# EAGLE design AUX power board (EAGLE 7.5.0)
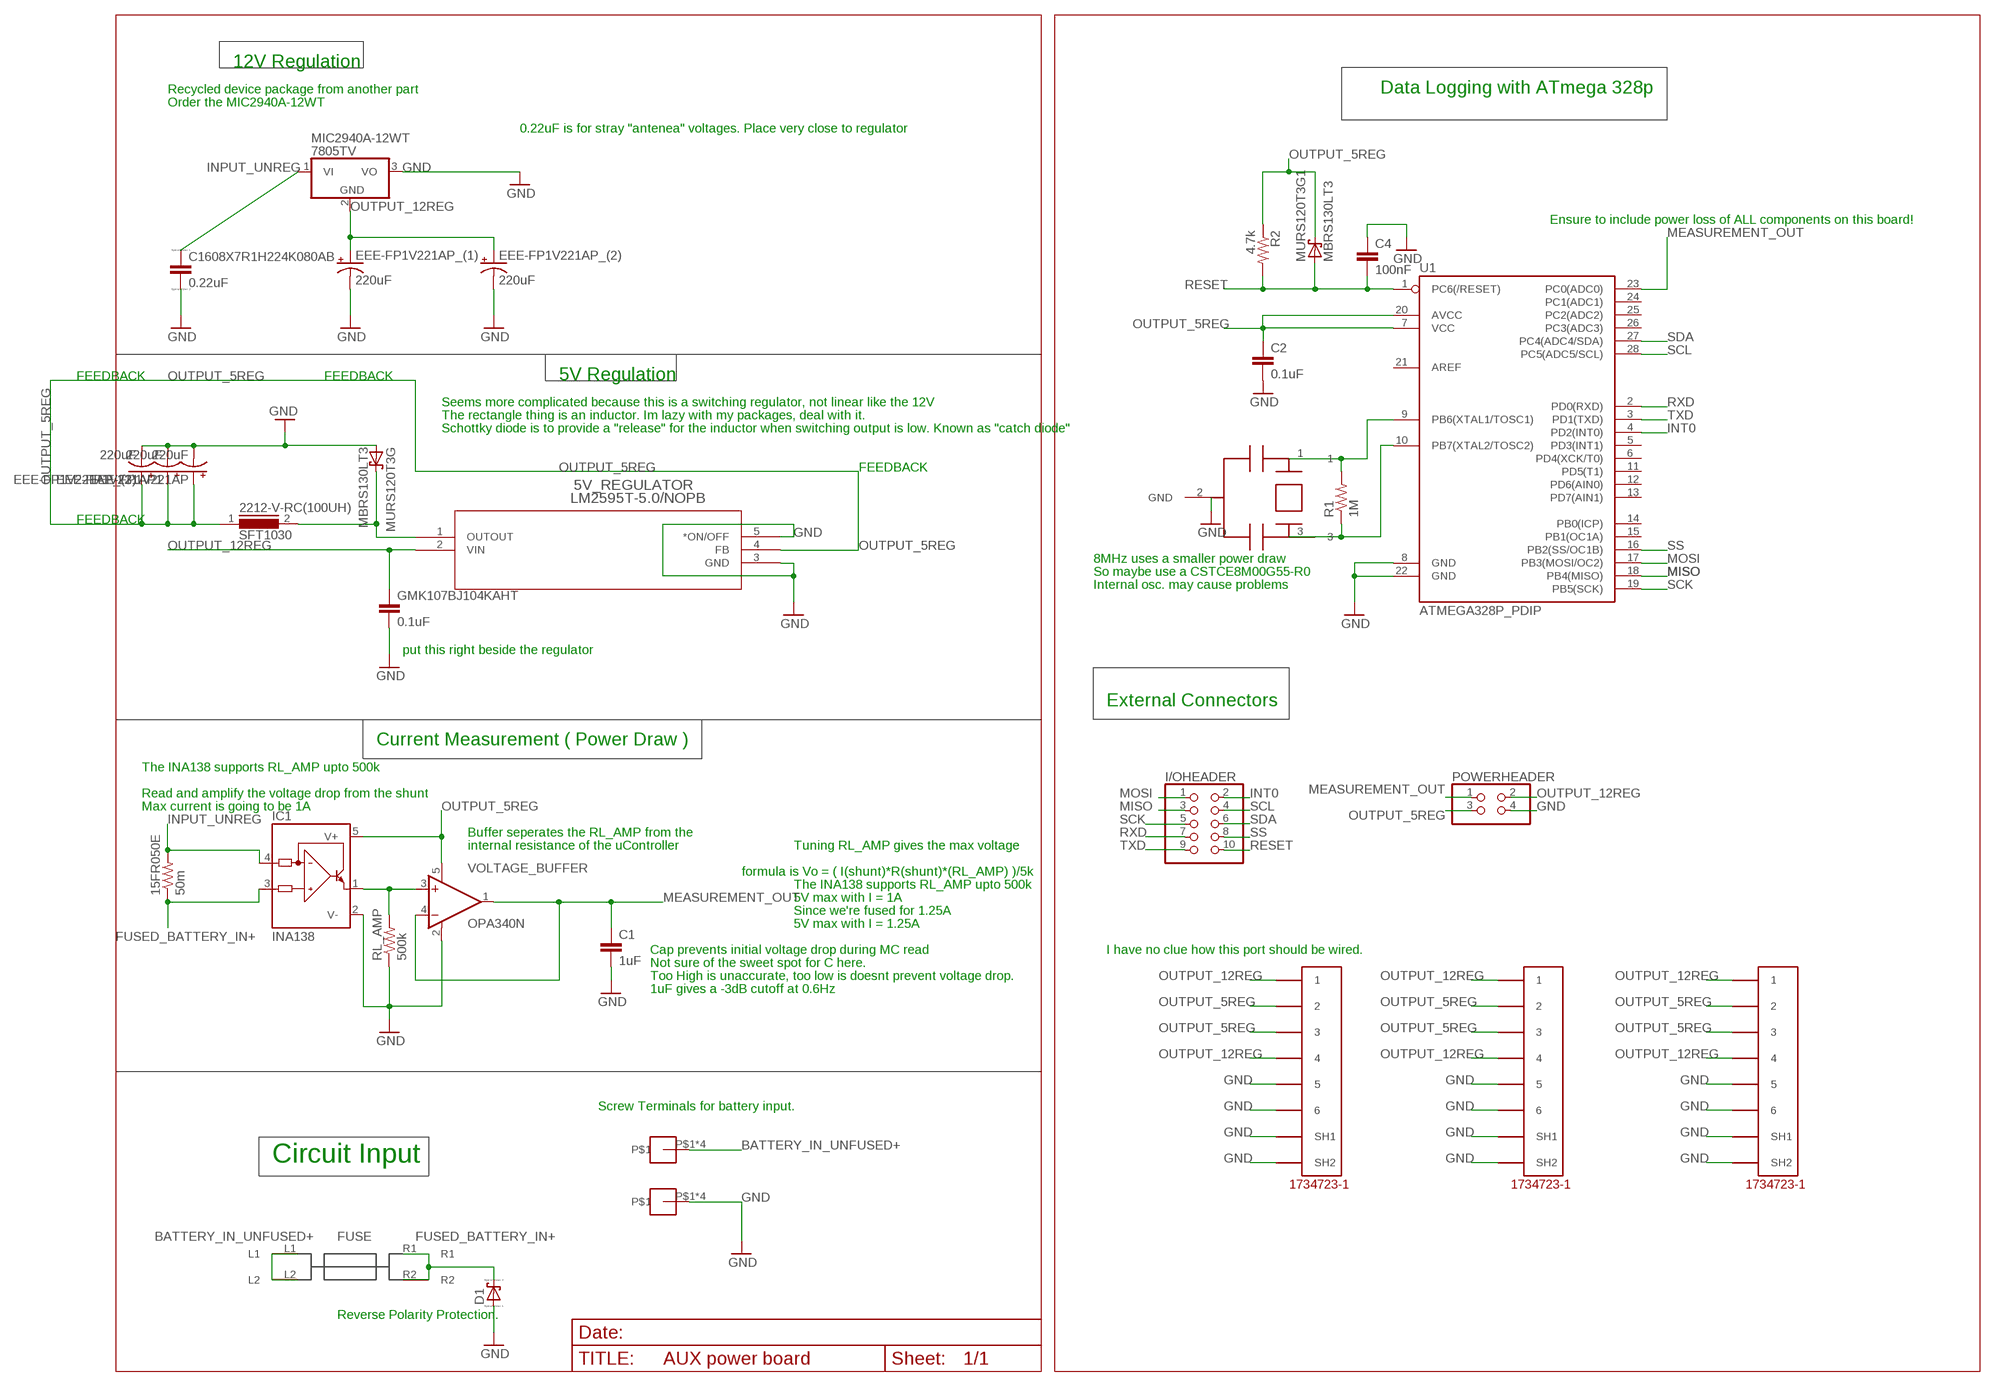
[diagram p0: schematic, sheet 1]

## Parts
5V_REGULATOR  LM2595T-5.0/NOPB  [T05D]
15FR050E  50m  R-US_0617/22  [0617/22]
2212-V-RC(100UH)  SFT1030  [SFT1030]
C1  1uF  C-EUC0603  [C0603]
C2  0.1uF  C-EUC0603  [C0603]
C4  100nF  C-EUC0603  [C0603]
C1608X7R1H224K080AB  0.22uF  CC0603  [C0603]
D1  SCHOTTKY-DIODESMC  [DIODE_SMC]
EEE-FP1V221AP  220uF  CPOL-US175TMP-0808  [175TMP-0808]
EEE-FP1V221AP1  220uF  CPOL-US175TMP-0808  [175TMP-0808]
EEE-FP1V221AP_(1)  220uF  CPOL-US175TMP-0808  [175TMP-0808]
EEE-FP1V221AP_(2)  220uF  CPOL-US175TMP-0808  [175TMP-0808]
EEE-FP1V221AP_(3)  220uF  CPOL-US175TMP-0808  [175TMP-0808]
GMK107BJ104KAHT  0.1uF  C-EUC0603  [C0603]
I/OHEADER  PINHD-2X5  [2X05]
IC1  INA138  [SOT23-5]
MIC2940A-12WT  7805TV  [TO220V]
MINIBLADE  3568  [3568]
MURS120T3G  MBRS130LT3  [SMB]
MURS120T3G1  MBRS130LT3  [SMB]
POWERHEADER  PINHD-2X2  [2X02]
R1  1M  R-US_R0603  [R0603]
R2  4.7k  R-US_R0603  [R0603]
RL_AMP  500k  R-US_R0603  [R0603]
U1  ATMEGA328P_PDIP  [DIL28-3]
U$1  CSTCE16M0V53-R0  [RESONATOR]
U$3  5555140-6  [1734723-1_RJ11]
U$4  5555140-6  [1734723-1_RJ11]
U$5  5555140-6  [1734723-1_RJ11]
U$6  SCREW-8191  [SCREW-8191]
U$7  SCREW-8191  [SCREW-8191]
VOLTAGE_BUFFER  OPA340N  [SOT23-5]

## Nets
BATTERY_IN_UNFUSED+: MINIBLADE.L1 MINIBLADE.L2 U$6.P$1 U$6.P$2 U$6.P$3 U$6.P$4
FUSED_BATTERY_IN+: 15FR050E.1 D1.C(A) IC1.3(IN+) MINIBLADE.R1 MINIBLADE.R2
GND: 5V_REGULATOR.3(GND) 5V_REGULATOR.5(*ON/OFF) C1.2 C2.2 C4.1 C1608X7R1H224K080AB.2 D1.A(C) EEE-FP1V221AP1.- EEE-FP1V221AP.- EEE-FP1V221AP_(1).- EEE-FP1V221AP_(2).- EEE-FP1V221AP_(3).- GMK107BJ104KAHT.2 IC1.2(V-) MIC2940A-12WT.3(VO) MURS120T3G.A POWERHEADER.4 RL_AMP.1 U1.8(GND) U1.22(GND) U$1.2(GND) U$3.5 U$3.6 U$3.SH1 U$3.SH2 U$4.5 U$4.6 U$4.SH1 U$4.SH2 U$5.5 U$5.6 U$5.SH1 U$5.SH2 U$7.P$1 U$7.P$2 U$7.P$3 U$7.P$4 VOLTAGE_BUFFER.2(V-)
INPUT_UNREG: 15FR050E.2 C1608X7R1H224K080AB.1 IC1.4(IN-) MIC2940A-12WT.1(VI)
INT0: I/OHEADER.2 U1.4(PD2(INT0))
MEASUREMENT_OUT: C1.1 POWERHEADER.1 U1.23(PC0(ADC0)) VOLTAGE_BUFFER.1(OUT) VOLTAGE_BUFFER.4(-IN)
MISO: I/OHEADER.3 U1.18(PB4(MISO))
MOSI: I/OHEADER.1 U1.17(PB3(MOSI/OC2))
N$1: 5V_REGULATOR.1(OUTOUT) 2212-V-RC(100UH).2 MURS120T3G.C
N$3: IC1.1(OUT) RL_AMP.2 VOLTAGE_BUFFER.3(+IN)
N$18: R1.2 U1.9(PB6(XTAL1/TOSC1)) U$1.1
N$19: R1.1 U1.10(PB7(XTAL2/TOSC2)) U$1.3
OUTPUT_5REG: 5V_REGULATOR.4(FB) 2212-V-RC(100UH).1 C2.1 EEE-FP1V221AP1.+ EEE-FP1V221AP.+ EEE-FP1V221AP_(3).+ IC1.5(V+) MURS120T3G1.C POWERHEADER.3 R2.1 U1.7(VCC) U1.20(AVCC) U$3.2 U$3.3 U$4.2 U$4.3 U$5.2 U$5.3 VOLTAGE_BUFFER.5(V+)
OUTPUT_12REG: 5V_REGULATOR.2(VIN) EEE-FP1V221AP_(1).+ EEE-FP1V221AP_(2).+ GMK107BJ104KAHT.1 MIC2940A-12WT.2(GND) POWERHEADER.2 U$3.1 U$3.4 U$4.1 U$4.4 U$5.1 U$5.4
RESET: C4.2 I/OHEADER.10 MURS120T3G1.A R2.2 U1.1(PC6(/RESET))
RXD: I/OHEADER.7 U1.2(PD0(RXD))
SCK: I/OHEADER.5 U1.19(PB5(SCK))
SCL: I/OHEADER.4 U1.28(PC5(ADC5/SCL))
SDA: I/OHEADER.6 U1.27(PC4(ADC4/SDA))
SS: I/OHEADER.8 U1.16(PB2(SS/OC1B))
TXD: I/OHEADER.9 U1.3(PD1(TXD))
Unconnected: U1.5(PD3(INT1)) U1.6(PD4(XCK/T0)) U1.11(PD5(T1)) U1.12(PD6(AIN0)) U1.13(PD7(AIN1)) U1.14(PB0(ICP)) U1.15(PB1(OC1A)) U1.21(AREF) U1.24(PC1(ADC1)) U1.25(PC2(ADC2)) U1.26(PC3(ADC3))

## Notes on the sheet
- 12V Regulation
- Recycled device package from another part | Data Logging with ATmega 328p
- Order the MIC2940A-12WT
- 0.22uF is for stray "antenea" voltages. Place very close to regulator
- Ensure to include power loss of ALL components on this board!
- FEEDBACK | FEEDBACK | 5V Regulation
- Seems more complicated because this is a switching regulator, not linear like the 12V
- The rectangle thing is an inductor. Im lazy with my packages, deal with it.
- Schottky diode is to provide a "release" for the inductor when switching output is low. Known as "catch diode"
- FEEDBACK
- FEEDBACK
- 8MHz uses a smaller power draw
- So maybe use a CSTCE8M00G55-R0
- Internal osc. may cause problems
- put this right beside the regulator
- External Connectors
- Current Measurement ( Power Draw )
- The INA138 supports RL_AMP upto 500k
- Read and amplify the voltage drop from the shunt
- Max current is going to be 1A
- Buffer seperates the RL_AMP from the
- internal resistance of the uController | Tuning RL_AMP gives the max voltage
- formula is Vo = ( I(shunt)*R(shunt)*(RL_AMP) )/5k
- The INA138 supports RL_AMP upto 500k
- 5V max with I = 1A
- Since we're fused for 1.25A
- 5V max with I = 1.25A
- Cap prevents initial voltage drop during MC read | I have no clue how this port should be wired.
- Not sure of the sweet spot for C here.
- Too High is unaccurate, too low is doesnt prevent voltage drop.
- 1uF gives a -3dB cutoff at 0.6Hz
- Screw Terminals for battery input.
- Circuit Input
- Reverse Polarity Protection.

## Library data of the parts
5V_REGULATOR = LM2595T-5:LM2595T-5.0/NOPB; COPYRIGHT: Copyright C 2015 Accelerated Designs. All rights reserved; MANUFACTURER_PART_NUMBER: LM2595T50; VENDOR: National Semiconductor
15FR050E R2 RL_AMP = resistor:R-US_: RESISTOR, American symbol
2212-V-RC(100UH) = inductors:SFT1030: INDUCTOR
C1 C2 = resistor:C-EU: CAPACITOR, European symbol
C4 GMK107BJ104KAHT = rcl:C-EU: CAPACITOR, European symbol
C1608X7R1H224K080AB = eagle-ltspice:C: CAPACITOR, European symbol; SPICEMODEL: NONE; SPICEPREFIX: C
D1 = eagle-ltspice:SCHOTTKY-DIODE: Schottky Diode; SPICEMODEL: NONE; SPICEPREFIX: D; SPICETYPE: diode
EEE-FP1V221AP EEE-FP1V221AP1 EEE-FP1V221AP_(1) EEE-FP1V221AP_(2) EEE-FP1V221AP_(3) = rcl:CPOL-US: POLARIZED CAPACITOR, American symbol
I/OHEADER = pinhead:PINHD-2X5: PIN HEADER
IC1 = burr-brown:INA138: High-Side Measurement Current Shunt Monitor; MF: TEXAS INSTRUMENTS; MPN: INA138NA/250; OC_FARNELL: 1564888; OC_NEWARK: 80K5906
MIC2940A-12WT = linear:78*: Positive VOLTAGE REGULATOR Source: http://cache.national.com/ds/LM/LM78L05.pdf http://www.fairchildsemi.com/ds/LM/LM7805.pdf
MINIBLADE = fuse:3568
MURS120T3G MURS120T3G1 = diode:MBRS130LT3: Schottky Power Rectifier Source: http://www.onsemi.com/pub/Collateral/MBRS130LT3-D.PDF
POWERHEADER = pinhead:PINHD-2X2: PIN HEADER
R1 = rcl:R-US_: RESISTOR, American symbol
U1 = SparkFun-DigitalIC:ATMEGA328P_PDIP: uC used in the Arduino 32kb flash, 1k EEPROM, 2k SRAM This is the through-hole version of this chip.
U$1 = arduino_Uno_Rev3-02-TH:CSTCE16M0V53-R0
U$3-U$5 = 5555140-6 RJ11:5555140-6
U$6 U$7 = Shell2013:SCREW-8191
VOLTAGE_BUFFER = burr-brown:OPA340: Rail-to-Rail Operational Amplifiers Single-Supply, MicroAmplifier(TM) Series; MPN: OPA340NA/3KG4; OC_FARNELL: 1234805; OC_NEWARK: 13M5177

## Board
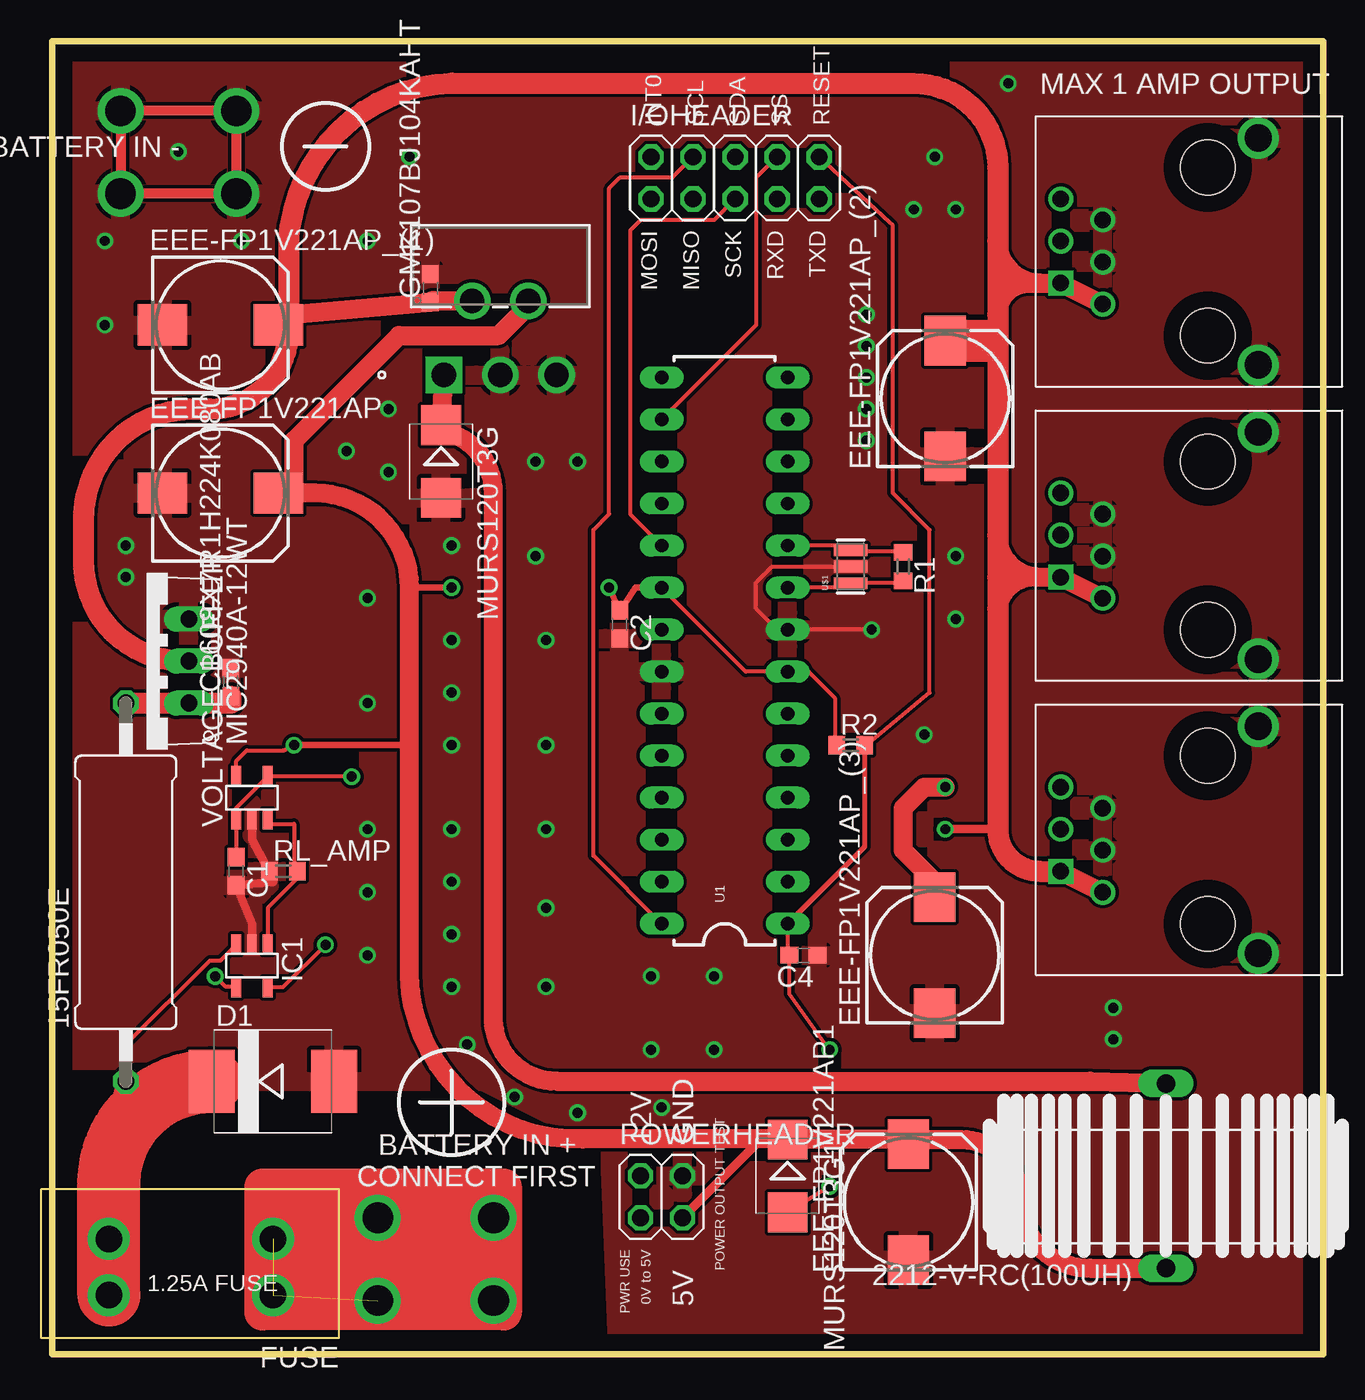
[diagram p1: board, top side]
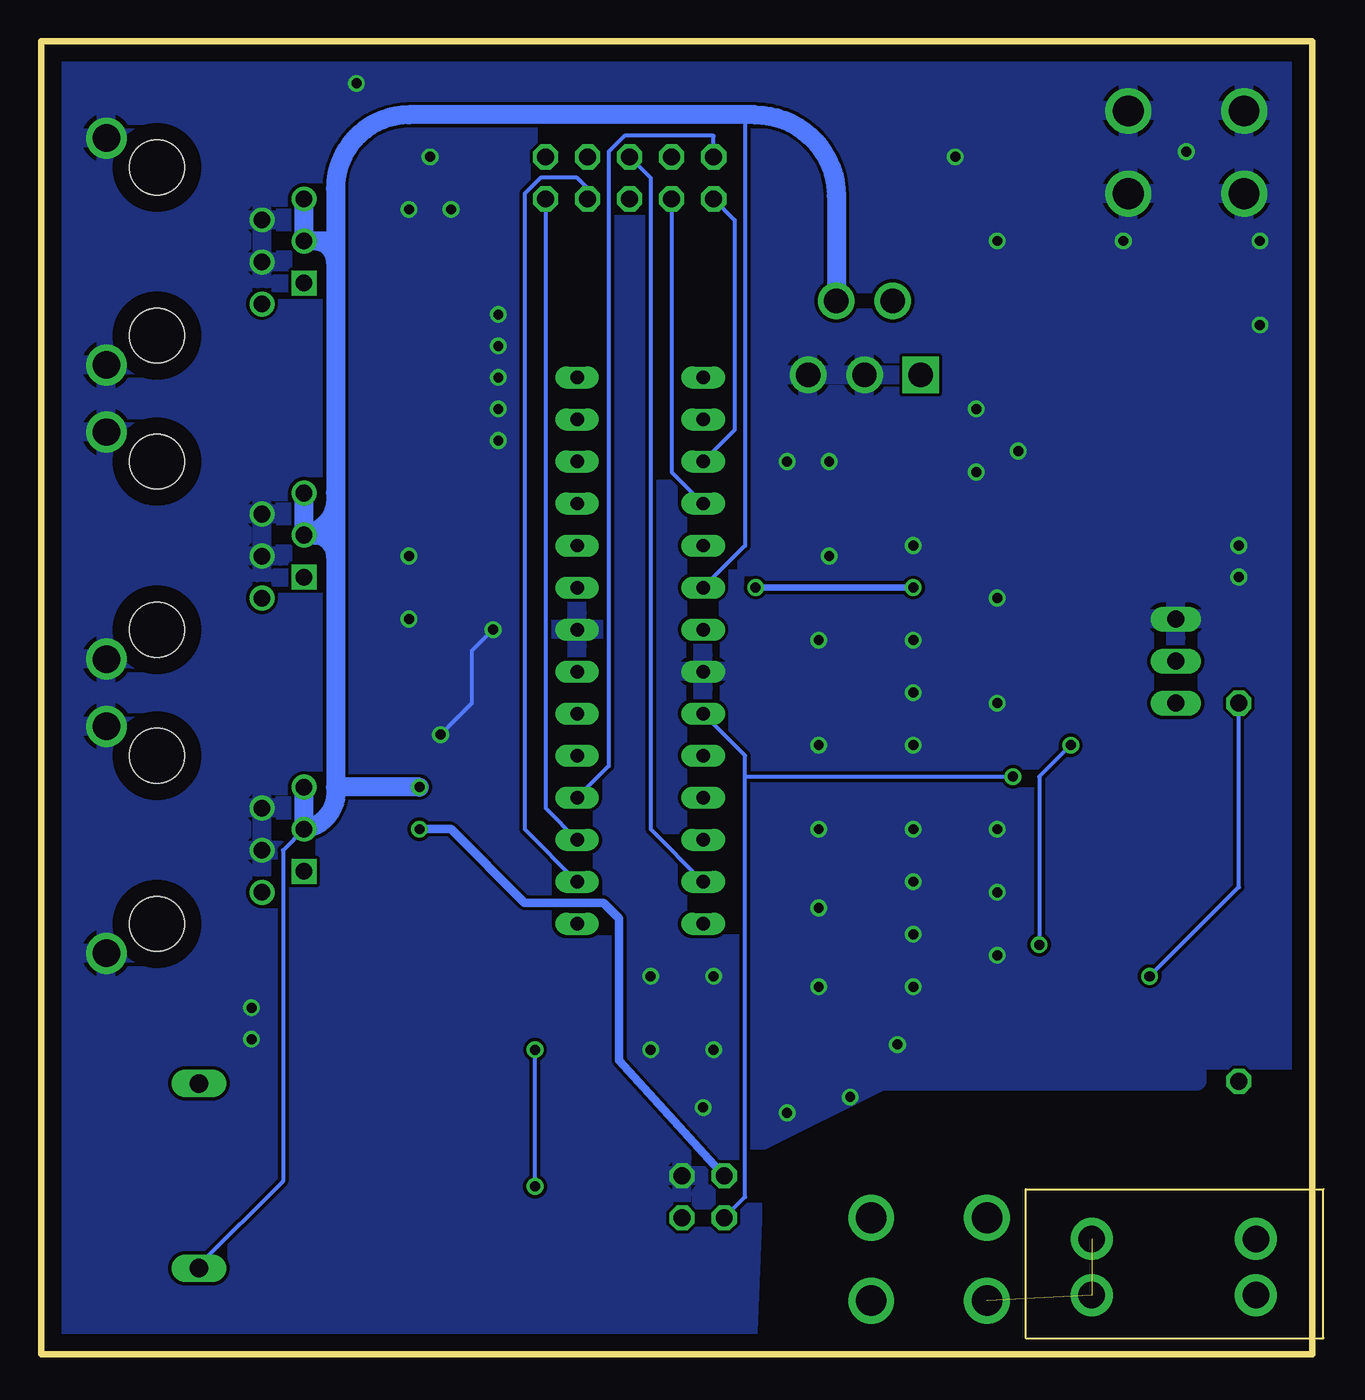
[diagram p2: board, bottom side, seen from below]

Size 76.83 x 79.38 mm. Coordinates in mm from the lower left corner, seen from the top.
Outline: 0,79.38 0,0 76.83,0 76.83,79.38 0,79.38
Copper layers (1*16): Top 0.035mm / dielectric 1.5mm / Bottom 0.035mm
Design rules "default": minimum track width 10mil, minimum drill 24mil, track to track 8mil, track to pad 8mil, pad to pad 8mil, via to via 8mil, smd to smd 8mil, copper to edge 40mil, drill to drill 8mil, minimum pad ring 10mil, minimum via ring 8mil, stop-mask expansion 4mil, vias tented up to drill 0mil, thermal gap 10mil

### Footprints (pad centres in the part's own frame; a part is rotated, then mirrored left to right if it is on the bottom)
T05D = drill 1.473 pad 1.981 square: 1 -6.807,-13.183 | drill 1.473 pad 1.981: 2 -5.105,-8.712; 3 -3.404,-13.183; 4 -1.702,-8.712; 5 0,-13.183
0617/22 = drill 1.016 octagon: 1 -11.43,0; 2 11.43,0
SFT1030 = drill 1.118 long: 1 -5.588,0; 2 5.588,0
C0603 = smd 1.1 x 1: 1 -0.85,0; 2 0.85,0
DIODE_SMC = smd 2.8 x 3.8: A 3.7,0; C -3.7,0
175TMP-0808 = smd 3 x 2.5: + 3.5,0; - -3.5,0
2X05 = drill 1.016 octagon: 1 -5.08,-1.27; 2 -5.08,1.27; 3 -2.54,-1.27; 4 -2.54,1.27; 5 0,-1.27; 6 0,1.27; 7 2.54,-1.27; 8 2.54,1.27; 9 5.08,-1.27; 10 5.08,1.27
SOT23-5 = smd 0.6 x 1.2: 1 -0.95,-1.306; 2 0,-1.306; 3 0.95,-1.306; 4 0.95,1.306; 5 -0.95,1.306
TO220V = drill 1.016 long: 1 -2.54,-2.54; 2 0,-2.54; 3 2.54,-2.54
3568 = drill 1.6 pad 2.54: L1 0,3.4; L2 0,0; R1 9.92,3.4; R2 9.92,0
SMB = smd 2.4 x 2.4: A 2.2,0; C -2.2,0
2X02 = drill 1.016 octagon: 1 -1.27,-1.27; 2 -1.27,1.27; 3 1.27,-1.27; 4 1.27,1.27
R0603 = smd 1 x 1.1: 1 -0.85,0; 2 0.85,0
DIL28-3 = drill 0.813 long: 1 -16.51,-3.81; 2 -13.97,-3.81; 3 -11.43,-3.81; 4 -8.89,-3.81; 5 -6.35,-3.81; 6 -3.81,-3.81; 7 -1.27,-3.81; 8 1.27,-3.81; 9 3.81,-3.81; 10 6.35,-3.81; 11 8.89,-3.81; 12 11.43,-3.81; 13 13.97,-3.81; 14 16.51,-3.81; 15 16.51,3.81; 16 13.97,3.81; 17 11.43,3.81; 18 8.89,3.81; 19 6.35,3.81; 20 3.81,3.81; 21 1.27,3.81; 22 -1.27,3.81; 23 -3.81,3.81; 24 -6.35,3.81; 25 -8.89,3.81; 26 -11.43,3.81; 27 -13.97,3.81; 28 -16.51,3.81
RESONATOR = smd 0.7 x 2: 1 -1,0; 2 0,0; 3 1,0
1734723-1_RJ11 = drill 1 square: 1 -2.54,2.54 | drill 1: 2 0,2.54; 3 2.54,2.54; 4 -3.81,0; 5 -1.27,0; 6 1.27,0 | drill 1.65: SH1 -7.5,-9.4; SH2 6.22,-9.4 | hole 3.3: -5.72,-6.35; 4.44,-6.35
SCREW-8191 = drill 1.85: P$1 0,0; P$2 0,5; P$3 7,5; P$4 7,0

### Placement (x,y rotation side)
5V_REGULATOR  30.48,72.39 0 top
15FR050E  4.44,27.94 90 top
2212-V-RC(100UH)  67.31,10.79 90 top
C1  11.11,29.21 270 top
C2  34.29,44.13 270 top
C4  45.4,24.13 180 top
C1608X7R1H224K080AB  10.79,40.64 90 top
D1  13.33,16.51 0 top
EEE-FP1V221AP  10.16,52.07 0 top
EEE-FP1V221AP1  51.75,9.21 90 top
EEE-FP1V221AP_(1)  10.16,62.23 0 top
EEE-FP1V221AP_(2)  53.98,57.79 90 top
EEE-FP1V221AP_(3)  53.34,24.13 90 top
GMK107BJ104KAHT  22.86,64.45 90 top
I/OHEADER  41.28,71.12 0 top
IC1  12.06,23.49 180 top
MIC2940A-12WT  5.72,41.91 90 top
MINIBLADE  13.33,6.98 180 top
MURS120T3G  23.49,53.98 270 top
MURS120T3G1  44.45,10.79 270 top
POWERHEADER  36.83,9.53 0 top
R1  51.44,47.62 270 top
R2  48.26,36.83 0 top
RL_AMP  13.97,29.21 0 top
U1  40.64,42.55 90 top
U$1  48.26,47.62 90 top
U$3  63.5,67.31 90 top
U$4  63.5,49.53 90 top
U$5  63.5,31.75 90 top
U$6  26.67,8.26 180 top
U$7  4.13,70.17 0 top
VOLTAGE_BUFFER  12.06,33.66 0 top

### Tracks (layer width: path | path; a pad name or v marks a point on that pad's centre or on a via)
BATTERY_IN_UNFUSED+  (2 unrouted)
  pour Top: 12.7,9.53 12.7,2.54 27.94,1.91 28.57,9.53
FUSED_BATTERY_IN+
  Top 0.254: 15FR050E.1 4.44,18.73 9.52,23.81 10.16,23.81 11.11,24.77 IC1.3
  Top 1.27: MINIBLADE.R1 15FR050E.1
  Top 1.651: MINIBLADE.R2 MINIBLADE.R1
  Top 3.81: MINIBLADE.R1 3.42,10.29 arc-90 D1.C
GND  (via drill 0.6)
  Top 0.254: U$1.2 43.5,47.62 42.55,46.67 42.55,45.09 43.82,43.82 U1.8 v49.53,43.82
  Top 0.508: VOLTAGE_BUFFER.2 12.06,31.12 RL_AMP.1 13.33,28.58 C1.2 12.06,26.03 IC1.2
  Bottom 0.254: v52.71,37.47 50.8,39.37 50.8,42.55 v49.53,43.82
  other vias: 49.21,59.06 52.07,69.22 49.21,57.15 54.61,44.45 49.21,55.25 54.61,48.26 19.05,67.31 21.59,72.39 20.32,53.34 20.32,57.15 19.05,45.72 19.05,39.37 24.13,36.83 24.13,40.01 24.13,43.18 24.13,31.75 24.13,28.58 24.13,25.4 24.13,22.23 19.05,27.94 19.05,31.75 19.05,24.13 36.2,22.86 40.01,22.86 36.2,18.41 40.01,18.41 64.13,19.05 64.13,20.95 17.78,54.61 31.75,53.98 29.21,53.98 25.08,18.73 27.94,15.56 31.75,14.6 36.83,14.92 29.85,26.99 53.34,72.39 57.79,76.84 49.21,62.86 54.61,69.22 49.21,60.96 4.44,48.9 4.44,46.99 24.13,48.9 29.21,48.26 29.85,43.18 29.85,36.83 29.85,31.75 29.85,22.23 3.17,67.31 11.43,67.31 3.17,62.23 7.62,72.71
  pour Bottom: -8.89,83.19 -8.89,-1.91 0,-1.91 0,17.78 6.99,17.78 6.99,16.51 26.04,16.51 33.66,12.7 34.29,-3.17 95.25,-2.54 95.25,83.19
  pour Top: -8.89,83.19 -8.89,-1.91 0,-1.91 0,17.78 6.99,17.78 6.99,16.51 26.04,16.51 33.66,12.7 34.29,-3.17 95.25,-2.54 95.25,83.19
INPUT_UNREG  (via drill 0.61)
  Top 0.254: v9.84,22.86 10.48,22.23 11.11,22.23 IC1.4
  Top 1.27: 15FR050E.2 MIC2940A-12WT.1 10.79,39.37 C1608X7R1H224K080AB.1
  Bottom 0.254: v9.84,22.86 4.44,28.26 15FR050E.2
INT0
  Bottom 0.254: U1.4 42.55,35.56 42.55,72.71 41.59,73.66 36.2,73.66 I/OHEADER.2
MEASUREMENT_OUT  (via drill 0.61)
  Top 0.254: C1.1 11.11,32.07 VOLTAGE_BUFFER.1 11.11,32.39 11.11,33.02 13.02,34.93 | 13.02,34.93 VOLTAGE_BUFFER.4 | v18.1,34.93 13.02,34.93
  Bottom 0.254: U1.23 34.29,36.2 34.29,34.93 | 34.29,34.93 34.29,9.53 POWERHEADER.1 | 34.29,34.93 v18.1,34.93
MISO
  Bottom 0.254: U1.18 38.73,53.34 I/OHEADER.3
MOSI
  Bottom 0.254: U1.17 34.93,55.88 34.93,68.58 I/OHEADER.1
N$1
  Top 1.143: 2212-V-RC(100UH).2 62.74,16.51 30.48,16.51 arc-90 26.67,20.32 26.67,52.07 arc90 22.86,55.88 23.2,55.88 arc90 MURS120T3G.C 5V_REGULATOR.1
N$3
  Top 0.254: VOLTAGE_BUFFER.3 13.02,32.07 14.61,32.07 14.61,29.21 RL_AMP.2 14.92,29.21 14.92,28.89 13.02,26.99 IC1.1 13.02,25.08
N$4
  Top 1.143: 46.36,13.02 32.07,13.02 arc-90 21.59,22.86 21.59,44.45
N$5
  Top 1.143: 14.61,52.7 14.61,55.25 20.95,61.59 26.99,61.59 28.57,63.18
N$6
  Top 2.184: 12.7,10.16 27.3,10.16 27.3,2.54 12.7,2.54 12.7,10.16 | 12.7,10.16 20.32,3.18 26.67,3.18 19.68,8.26 15.24,8.26 15.24,4.45 19.68,4.45 19.68,6.98 18.41,6.98
N$7
  Top 2.184: 20.95,3.81 20.95,8.26 26.04,8.26 26.04,4.45 21.59,4.45 24.76,6.98 13.97,6.98 13.97,5.08
N$18
  Top 0.254: R1.2 51.44,46.67 48.26,46.67 U$1.1 48.26,46.36 U1.9
N$19
  Top 0.254: R1.1 51.44,48.58 48.26,48.58 U$1.3 48.26,48.9 U1.10
OUTPUT_5REG  (via drill 0.6)
  Top 0.254: 34.61,45.4 C2.1 | 47.31,36.83 R2.1 47.31,36.93 47.31,39.69 45.72,41.27 U1.7 41.91,41.27 U1.20 | VOLTAGE_BUFFER.5 11.11,35.88 11.75,36.51 13.97,36.51 v14.61,36.83 | v16.51,24.77 13.93,22.19 IC1.5
  Top 0.381: 42.84,12.99 MURS120T3G1.C
  Top 0.406: 34.61,45.4 35.24,46.36 U1.20 | 21.59,46.36 v24.13,46.36 | v33.66,46.36 C2.1 | v14.61,36.83 21.59,36.83 21.59,43.82
  Top 0.508: POWERHEADER.3 42.84,12.99
  Top 1.143: 2212-V-RC(100UH).1 62.74,5.21 arc-90 58.42,9.53 arc90 54.95,12.99 52.04,12.99 | 52.04,12.99 MURS120T3G1.C | 21.59,43.82 21.59,46.36 arc90 15.88,52.07 EEE-FP1V221AP.+ | EEE-FP1V221AP1.+ 52.04,12.99 | EEE-FP1V221AP_(3).+ 53.34,28.58 51.44,30.48 51.44,33.02 52.71,34.29 v53.98,34.29
  Bottom 0.254: U1.20 34.29,48.9 34.29,74.93 | U$5.2 62.23,30.48 62.23,10.48 67.31,5.4 2212-V-RC(100UH).1 | v14.61,36.83 16.51,34.93 v16.51,24.77
  Bottom 0.406: v24.13,46.36 v33.66,46.36
  Bottom 1.143: U$3.3 U$3.2 60.32,67.31 | 59.05,67.31 59.05,70.48 arc90 54.61,74.93 34.29,74.93 33.68,74.93 arc90 28.78,70.03 5V_REGULATOR.4 | 59.05,67.31 59.05,66.04 | 59.05,66.04 59.05,52.07 | 59.05,52.07 arc90 U$4.2 | U$4.2 U$4.3 | 59.05,52.07 59.05,48.26 | 59.05,48.26 59.05,34.29 | 59.05,34.29 arc90 U$5.2 U$5.3 | 59.05,66.04 arc-90 60.32,67.31 | 59.05,48.26 arc-90 60.32,49.53 U$4.2 | 59.05,67.31 60.32,67.31 | 59.69,49.53 U$4.2 | v53.98,34.29 59.05,34.29
OUTPUT_12REG  (via drill 0.6)
  Top 0.508: v53.98,31.75 57.15,31.75
  Top 1.016: 56.52,61.28 57.15,61.59
  Top 1.143: 57.15,67.31 arc90 59.69,64.77 | 59.69,64.77 U$3.1 U$3.4 | 57.15,49.53 arc90 59.69,46.99 | 59.69,46.99 U$4.1 U$4.4 | U$5.1 U$5.4 | 57.15,45.09 arc-90 59.69,46.99 | 57.15,46.99 59.05,46.99 | 57.15,62.86 arc-90 59.05,64.77 59.69,64.77 | 5V_REGULATOR.2 23.14,63.68 arc90 GMK107BJ104KAHT.1 14.29,62.86 arc-90 EEE-FP1V221AP_(1).+
  Top 1.27: U$5.1 59.69,29.21 arc-90 57.15,31.75 57.15,45.09 57.15,46.99 57.15,49.53 57.15,61.59 57.15,62.86 57.15,67.31 57.15,71.75 arc90 52.07,76.84 25.08,76.84 arc90 14.29,67.31 14.29,62.86 14.29,61.91 arc-90 9.52,57.15 8.89,57.15 arc90 1.91,50.8 1.91,47.62 arc90 MIC2940A-12WT.2
  Top 2.54: EEE-FP1V221AP_(2).+ 56.52,61.28
  Bottom 0.508: POWERHEADER.2 41.91,17.78 41.91,26.35 42.86,27.3 47.62,27.3 52.07,31.75 v53.98,31.75
RESET  (via drill 0.6, 0.61)
  Top 0.254: 48.9,36.83 R2.2 49.21,36.83 53.02,40.01 53.02,49.85 50.8,52.07 50.8,68.25 50.64,68.41 | 50.8,68.26 50.64,68.41 | 50.64,68.41 I/OHEADER.10 | MURS120T3G1.A v46.99,10.16 | v46.99,18.41 44.55,21.8 C4.2 44.45,24.13 U1.1
  Top 0.305: U1.1 49.11,30.7 R2.2
  Bottom 0.254: v46.99,10.16 v46.99,18.41
RXD
  Bottom 0.254: U1.2 47.62,31.75 47.62,70.17 46.67,71.12 44.45,71.12 43.82,70.48 I/OHEADER.7
SCK
  Top 0.254: U1.19 34.93,50.8 34.93,67.95 35.56,68.58 40.01,68.58 I/OHEADER.5
SCL
  Top 0.254: U1.28 32.7,30.16 32.7,49.85 33.66,50.8 33.66,70.48 34.29,71.12 37.47,71.12 I/OHEADER.4
SDA
  Bottom 0.254: U1.27 40.01,31.75 40.01,71.12 I/OHEADER.6
SS
  Top 0.254: U1.16 42.55,62.23 42.55,71.12 I/OHEADER.8
TXD
  Bottom 0.254: U1.3 46.36,33.02 I/OHEADER.9

### Text on the board
tPlace: MAX 1 AMP OUTPUT | INT0 | SCL | SDA | SS | RESET | MOSI | MISO | SCK | RXD | TXD | 12V | GND | CONNECT FIRST | PWR USE | 0V to 5V | 5V | POWER OUTPUT TEST | 1.25A FUSE
tNames: BATTERY IN - | GND | BATTERY IN +